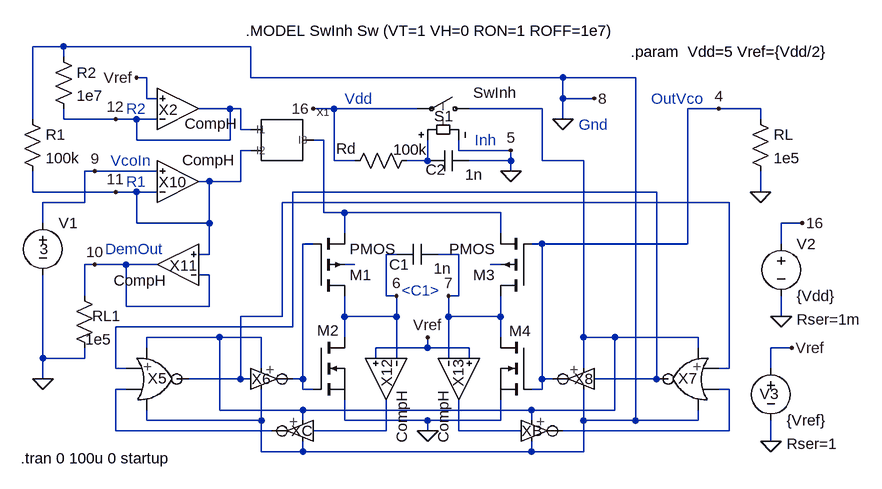
[diagram p0: schematic 46Vco1CompHTst.asc]
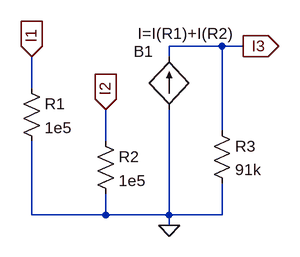
[diagram p1: sub-circuit i1i2i3mirror.asc]
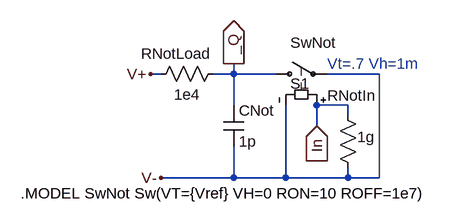
[diagram p2: sub-circuit noth.asc]
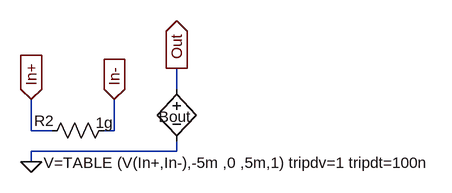
[diagram p3: sub-circuit comph.asc]
46Vco1CompHTst.asc, the LTspice schematic file:
Version 4
SHEET 1 1016 916
WIRE -304 208 -304 96
WIRE -304 320 -304 288
WIRE -288 368 -288 336
WIRE -288 576 -288 448
WIRE -288 608 -288 576
WIRE -256 96 -304 96
WIRE -256 112 -256 96
WIRE -256 208 -256 192
WIRE -224 336 -288 336
WIRE -224 336 -224 288
WIRE -224 480 -224 432
WIRE -224 576 -288 576
WIRE -224 576 -224 560
WIRE -208 288 -224 288
WIRE -208 432 -224 432
WIRE -176 208 -256 208
WIRE -176 320 -304 320
WIRE -176 592 -176 528
WIRE -176 688 -176 624
WIRE -160 432 -208 432
WIRE -160 496 -160 432
WIRE -160 592 -176 592
WIRE -160 624 -176 624
WIRE -144 208 -176 208
WIRE -144 240 -144 208
WIRE -144 320 -176 320
WIRE -144 368 -144 320
WIRE -128 144 -144 144
WIRE -128 176 -128 144
WIRE -128 560 -128 544
WIRE -128 672 -128 656
WIRE -112 176 -128 176
WIRE -112 208 -144 208
WIRE -112 288 -208 288
WIRE -112 320 -144 320
WIRE -112 432 -160 432
WIRE -32 304 -48 304
WIRE -32 368 -144 368
WIRE -32 368 -32 304
WIRE -32 416 -48 416
WIRE -32 416 -32 368
WIRE -32 448 -48 448
WIRE -32 496 -160 496
WIRE -32 496 -32 448
WIRE -16 544 -128 544
WIRE -16 656 -16 544
WIRE 0 192 -48 192
WIRE 0 240 -144 240
WIRE 0 240 0 192
WIRE 16 192 0 192
WIRE 16 224 16 192
WIRE 16 304 -32 304
WIRE 16 304 16 256
WIRE 16 608 -64 608
WIRE 16 608 16 512
WIRE 32 96 -256 96
WIRE 32 144 32 96
WIRE 32 224 16 224
WIRE 32 256 16 256
WIRE 32 608 16 608
WIRE 48 544 -16 544
WIRE 48 592 48 544
WIRE 48 672 -128 672
WIRE 48 672 48 624
WIRE 48 720 48 672
WIRE 64 688 -176 688
WIRE 80 512 16 512
WIRE 80 512 80 336
WIRE 96 528 -176 528
WIRE 96 528 96 320
WIRE 112 608 96 608
WIRE 112 608 112 400
WIRE 112 624 112 608
WIRE 112 656 -16 656
WIRE 112 672 112 656
WIRE 112 720 48 720
WIRE 112 720 112 704
WIRE 128 400 112 400
WIRE 128 624 112 624
WIRE 144 240 128 240
WIRE 144 352 144 240
WIRE 160 192 128 192
WIRE 160 272 160 192
WIRE 176 352 144 352
WIRE 176 384 176 352
WIRE 176 512 176 480
WIRE 176 544 176 512
WIRE 176 672 176 640
WIRE 192 272 160 272
WIRE 192 432 176 432
WIRE 224 576 224 560
WIRE 240 480 240 416
WIRE 240 688 128 688
WIRE 240 688 240 640
WIRE 256 416 240 416
WIRE 256 480 240 480
WIRE 256 512 176 512
WIRE 256 512 256 480
WIRE 256 576 256 512
WIRE 288 192 160 192
WIRE 304 272 272 272
WIRE 304 272 304 240
WIRE 304 560 224 560
WIRE 304 560 304 544
WIRE 304 672 176 672
WIRE 304 688 304 672
WIRE 320 272 304 272
WIRE 336 512 336 480
WIRE 336 576 336 512
WIRE 352 256 352 240
WIRE 352 416 320 416
WIRE 352 480 336 480
WIRE 352 480 352 416
WIRE 352 688 352 640
WIRE 368 560 304 560
WIRE 368 576 368 560
WIRE 416 352 176 352
WIRE 416 384 416 352
WIRE 416 432 400 432
WIRE 416 512 336 512
WIRE 416 512 416 480
WIRE 416 544 416 512
WIRE 416 672 304 672
WIRE 416 672 416 640
WIRE 432 256 352 256
WIRE 432 272 368 272
WIRE 432 272 432 256
WIRE 432 288 432 272
WIRE 448 688 352 688
WIRE 464 656 112 656
WIRE 464 672 464 656
WIRE 464 720 112 720
WIRE 464 720 464 704
WIRE 480 192 368 192
WIRE 480 272 480 192
WIRE 480 400 464 400
WIRE 480 608 480 400
WIRE 480 624 464 624
WIRE 480 624 480 608
WIRE 496 608 480 608
WIRE 512 144 32 144
WIRE 512 176 512 144
WIRE 512 208 512 176
WIRE 544 272 480 272
WIRE 544 544 544 272
WIRE 544 592 544 544
WIRE 544 672 544 624
WIRE 544 720 464 720
WIRE 544 720 544 672
WIRE 560 176 512 176
WIRE 592 544 544 544
WIRE 592 656 464 656
WIRE 592 656 592 544
WIRE 624 144 512 144
WIRE 624 672 544 672
WIRE 624 672 624 144
WIRE 656 320 96 320
WIRE 656 608 560 608
WIRE 656 608 656 320
WIRE 704 400 480 400
WIRE 704 400 704 192
WIRE 720 544 592 544
WIRE 720 560 720 544
WIRE 720 672 624 672
WIRE 720 672 720 656
WIRE 752 192 704 192
WIRE 768 336 80 336
WIRE 768 592 752 592
WIRE 768 592 768 336
WIRE 768 624 752 624
WIRE 768 688 512 688
WIRE 768 688 768 624
WIRE 816 192 752 192
WIRE 816 208 816 192
WIRE 816 320 816 288
WIRE 832 592 832 560
WIRE 832 704 832 672
WIRE 848 400 848 368
WIRE 848 512 848 480
WIRE 864 560 832 560
WIRE 880 368 848 368
FLAG -176 208 12
FLAG -208 288 9
FLAG -176 320 11
FLAG -208 432 10
FLAG -144 144 Vref
FLAG 752 192 4
FLAG 304 544 Vref
FLAG 256 480 6
FLAG 336 480 7
FLAG 512 208 0
FLAG 560 176 8
FLAG 128 192 16
FLAG 432 256 5
FLAG 816 320 0
FLAG -288 608 0
FLAG 848 512 0
FLAG 880 368 16
FLAG 432 288 0
FLAG 832 704 0
FLAG 864 560 Vref
FLAG 304 688 0
SYMBOL I1I2I3Mirror 80 240 R0
SYMATTR InstName X1
SYMBOL nmos 128 544 R0
WINDOW 0 6 -11 Left 0
WINDOW 3 56 72 Invisible 0
SYMATTR InstName M2
SYMBOL NorH -112 544 R0
WINDOW 3 1 30 Invisible 0
SYMATTR InstName X5
SYMBOL NotH 32 544 R0
WINDOW 0 1 64 Left 0
WINDOW 3 -42 30 Invisible 0
SYMATTR InstName X6
SYMBOL nmos 464 544 M0
WINDOW 0 1 -10 Left 0
WINDOW 3 56 72 Invisible 0
SYMATTR InstName M4
SYMBOL NorH 704 544 M0
WINDOW 3 1 30 Invisible 0
SYMATTR InstName X7
SYMBOL NotH 560 544 M0
WINDOW 0 1 64 Left 0
WINDOW 3 -42 30 Invisible 0
SYMATTR InstName X8
SYMBOL NotH 448 624 R0
WINDOW 0 1 64 Left 0
WINDOW 3 -42 30 Invisible 0
SYMATTR InstName XB
SYMBOL NotH 128 624 M0
WINDOW 0 1 64 Left 0
WINDOW 3 -42 30 Invisible 0
SYMATTR InstName XC
SYMBOL sw 384 192 M270
WINDOW 0 -11 41 VRight 0
WINDOW 3 25 -57 VRight 0
SYMATTR InstName S1
SYMATTR Value SwInh
SYMBOL res 176 288 R270
WINDOW 0 19 3 VTop 0
WINDOW 3 49 101 VBottom 0
SYMATTR InstName Rd
SYMATTR Value 100k
SYMBOL cap 320 400 R90
WINDOW 0 47 60 VBottom 0
WINDOW 3 22 -7 VTop 0
SYMATTR InstName C1
SYMATTR Value 1n
SYMATTR SpiceLine Rpar=1e9
SYMBOL res -272 96 R0
SYMATTR InstName R2
SYMATTR Value 1e7
SYMBOL res -320 192 R0
SYMATTR InstName R1
SYMATTR Value 100k
SYMBOL res 800 192 R0
SYMATTR InstName RL
SYMATTR Value 1e5
SYMBOL voltage -288 352 R0
WINDOW 123 0 0 Left 0
WINDOW 39 24 132 Left 0
WINDOW 3 -5 56 Left 0
SYMATTR Value 3
SYMATTR InstName V1
SYMBOL voltage 848 384 R0
WINDOW 123 0 0 Left 0
WINDOW 39 24 132 Left 0
SYMATTR SpiceLine Rser=1m
SYMATTR InstName V2
SYMATTR Value {Vdd}
SYMBOL res -240 464 R0
WINDOW 0 28 47 Left 0
WINDOW 3 17 83 Left 0
SYMATTR InstName RL1
SYMATTR Value 1e5
SYMBOL voltage 832 576 R0
WINDOW 123 0 0 Left 0
WINDOW 39 24 132 Left 0
WINDOW 0 -17 55 Left 0
SYMATTR SpiceLine Rser=1
SYMATTR InstName V3
SYMATTR Value {Vref}
SYMBOL Comph -80 368 M180
WINDOW 3 47 97 Center 0
SYMATTR InstName X10
SYMBOL Comph -80 496 R180
SYMATTR InstName X11
SYMBOL Comph 304 608 R90
SYMATTR InstName X12
SYMBOL Comph 288 608 M90
SYMATTR InstName X13
SYMBOL Comph -80 256 M180
WINDOW 3 51 41 Center 0
SYMATTR InstName X2
SYMBOL cap 368 256 R90
WINDOW 0 45 52 VBottom 0
WINDOW 3 22 -7 VTop 0
SYMATTR InstName C2
SYMATTR Value 1n
SYMATTR SpiceLine Rpar=1e7
SYMBOL pmos4 128 480 M180
SYMATTR InstName M1
SYMBOL pmos4 464 480 R180
SYMATTR InstName M3
TEXT -184 272 Left 0 ;VcoIn
TEXT -160 304 Left 0 ;R1
TEXT -160 192 Left 0 ;R2
TEXT -192 408 Left 0 ;DemOut
TEXT 648 176 Left 0 ;OutVco
TEXT 264 472 Left 0 ;<C1>
TEXT 536 216 Left 0 ;Gnd
TEXT 176 176 Left 0 ;Vdd
TEXT 24 72 Left 0 !.MODEL SwInh Sw (VT=1 VH=0 RON=1 ROFF=1e7)
TEXT 376 240 Left 0 ;Inh
TEXT 616 104 Left 0 !.param  Vdd=5 Vref={Vdd/2}
TEXT -322 730 Left 0 !.tran 0 100u 0 startup

i1i2i3mirror.asc, the sub-circuit schematic file:
Version 4
SHEET 1 880 680
WIRE -112 224 -112 176
WIRE -112 416 -112 304
WIRE 0 304 0 256
WIRE 0 416 -112 416
WIRE 0 416 0 384
WIRE 96 176 96 160
WIRE 96 416 0 416
WIRE 96 416 96 256
WIRE 96 432 96 416
WIRE 176 160 96 160
WIRE 176 288 176 160
WIRE 176 416 96 416
WIRE 176 416 176 368
WIRE 208 160 176 160
FLAG -112 176 I1
IOPIN -112 176 In
FLAG 0 256 I2
IOPIN 0 256 In
FLAG 96 432 0
FLAG 208 160 I3
IOPIN 208 160 Out
SYMBOL bi 96 256 R180
WINDOW 0 24 88 Left 0
WINDOW 3 -96 115 Left 0
SYMATTR InstName B1
SYMATTR Value I=I(R1)+I(R2)
SYMBOL res -128 208 R0
SYMATTR InstName R1
SYMATTR Value 1e5
SYMBOL res -16 288 R0
SYMATTR InstName R2
SYMATTR Value 1e5
SYMBOL res 160 272 R0
SYMATTR InstName R3
SYMATTR Value 91k

noth.asc, the sub-circuit schematic file:
Version 4
SHEET 1 880 680
WIRE 16 192 0 192
WIRE 128 192 96 192
WIRE 128 192 128 176
WIRE 128 240 128 192
WIRE 128 352 16 352
WIRE 128 352 128 304
WIRE 192 192 128 192
WIRE 208 352 128 352
WIRE 208 352 208 240
WIRE 256 272 256 240
WIRE 304 240 256 240
WIRE 304 256 304 240
WIRE 304 352 208 352
WIRE 304 352 304 336
WIRE 352 192 272 192
WIRE 352 352 304 352
WIRE 352 352 352 192
FLAG 128 176 _Q
IOPIN 128 176 Out
FLAG 256 272 In
IOPIN 256 272 In
FLAG 16 352 V-
FLAG 0 192 V+
SYMBOL sw 176 192 R270
WINDOW 0 -15 39 VRight 0
WINDOW 3 48 39 VRight 0
SYMATTR InstName S1
SYMATTR Value SwNot
SYMBOL res 288 240 R0
WINDOW 0 -16 -15 Left 0
WINDOW 3 30 49 Left 0
SYMATTR InstName RNotIn
SYMATTR Value 1g
SYMBOL cap 112 240 R0
SYMATTR InstName CNot
SYMATTR Value 1p
SYMBOL res 112 176 R90
WINDOW 0 0 72 VBottom 0
WINDOW 3 32 56 VTop 0
SYMATTR InstName RNotLoad
SYMATTR Value 1e4
TEXT -200 376 Left 0 !.MODEL SwNot Sw(VT={Vref} VH=0 RON=10 ROFF=1e7)
TEXT 272 176 Left 0 ;Vt=.7 Vh=1m

comph.asc, the sub-circuit schematic file:
Version 4
SHEET 1 880 680
WIRE -16 320 -16 272
WIRE -16 368 -16 352
WIRE 16 320 -16 320
WIRE 112 320 96 320
WIRE 112 320 112 272
WIRE 208 256 208 224
WIRE 208 352 -16 352
WIRE 208 352 208 336
FLAG -16 272 In+
IOPIN -16 272 In
FLAG 112 272 In-
IOPIN 112 272 In
FLAG 208 224 Out
IOPIN 208 224 Out
FLAG -16 368 0
SYMBOL res 112 304 R90
WINDOW 0 16 108 VBottom 0
WINDOW 3 -12 15 VTop 0
SYMATTR InstName R2
SYMATTR Value 1g
SYMBOL bv 208 240 R0
WINDOW 0 -28 59 Left 0
WINDOW 3 -205 129 Left 0
SYMATTR InstName Bout
SYMATTR Value V=TABLE (V(In+,In-),-5m ,0 ,5m,1) tripdv=1 tripdt=100n

The netlist it stands for:
* 46Vco1CompHTst.asc
XX1 12 11 N006 i1i2i3mirror params: I1I2I3Mirror
M2 6 N005 0 0 NMOS
XX5 N001 N002 N003 0 N004 NorH params: NorH  ; pins A B V+ V- Y
XX6 N004 N003 0 N005 noth params: NotH
M4 7 4 0 0 NMOS
XX7 N004 N012 N003 0 N001 NorH params: NorH  ; pins A B V+ V- Y
XX8 N001 N003 0 4 noth params: NotH
XXB N010 N003 0 N012 noth params: NotH
XXC N008 N003 0 N002 noth params: NotH
S1 N003 16 N009 0 SwInh
Rd 16 N009 100k
C1 7 6 1n Rpar=1e9
R2 0 12 1e7
R1 0 11 100k
RL 4 0 1e5
V1 9 0 3
V2 16 0 {Vdd} Rser=1m
RL1 10 0 1e5
V3 Vref 0 {Vref} Rser=1
XX10 9 11 11 comph params: CompH
XX11 11 10 10 comph params: CompH
XX12 Vref 6 N008 comph params: CompH
XX13 Vref 7 N010 comph params: CompH
XX2 Vref 12 12 comph params: CompH
C2 0 N009 1n Rpar=1e7
M1 6 N005 N006 N007 PMOS
M3 7 4 N006 N011 PMOS

* block symbol definitions
.subckt i1i2i3mirror I1 I2 I3
B1 0 I3 I=I(R1)+I(R2)
R1 I1 0 1e5
R2 I2 0 1e5
R3 I3 0 91k
.ends i1i2i3mirror

.subckt noth in V+ V- _Q
S1 _Q V- In V- SwNot
RNotIn In V- 1g
CNot _Q V- 1p
RNotLoad _Q V+ 1e4
.MODEL SwNot Sw(VT={Vref} VH=0 RON=10 ROFF=1e7)
* Vt=.7 Vh=1m
.ends noth

.subckt comph In+ In- Out
R2 In- In+ 1g
Bout Out 0 V=TABLE (V(In+,In-),-5m ,0 ,5m,1) tripdv=1 tripdt=100n
.ends comph

.model NMOS NMOS
.model PMOS PMOS
.lib standard.mos
* VcoIn
* R1
* R2
* DemOut
* OutVco
* <C1>
* Gnd
* Vdd
.MODEL SwInh Sw (VT=1 VH=0 RON=1 ROFF=1e7)
* Inh
.param  Vdd=5 Vref={Vdd/2}
.tran 0 100u 0 startup
.backanno
.end